# Altium schematic sheet PCB_Top.SchDoc
size A4; DocumentNumber: 1; SheetNumber: 1; SheetTotal: 8
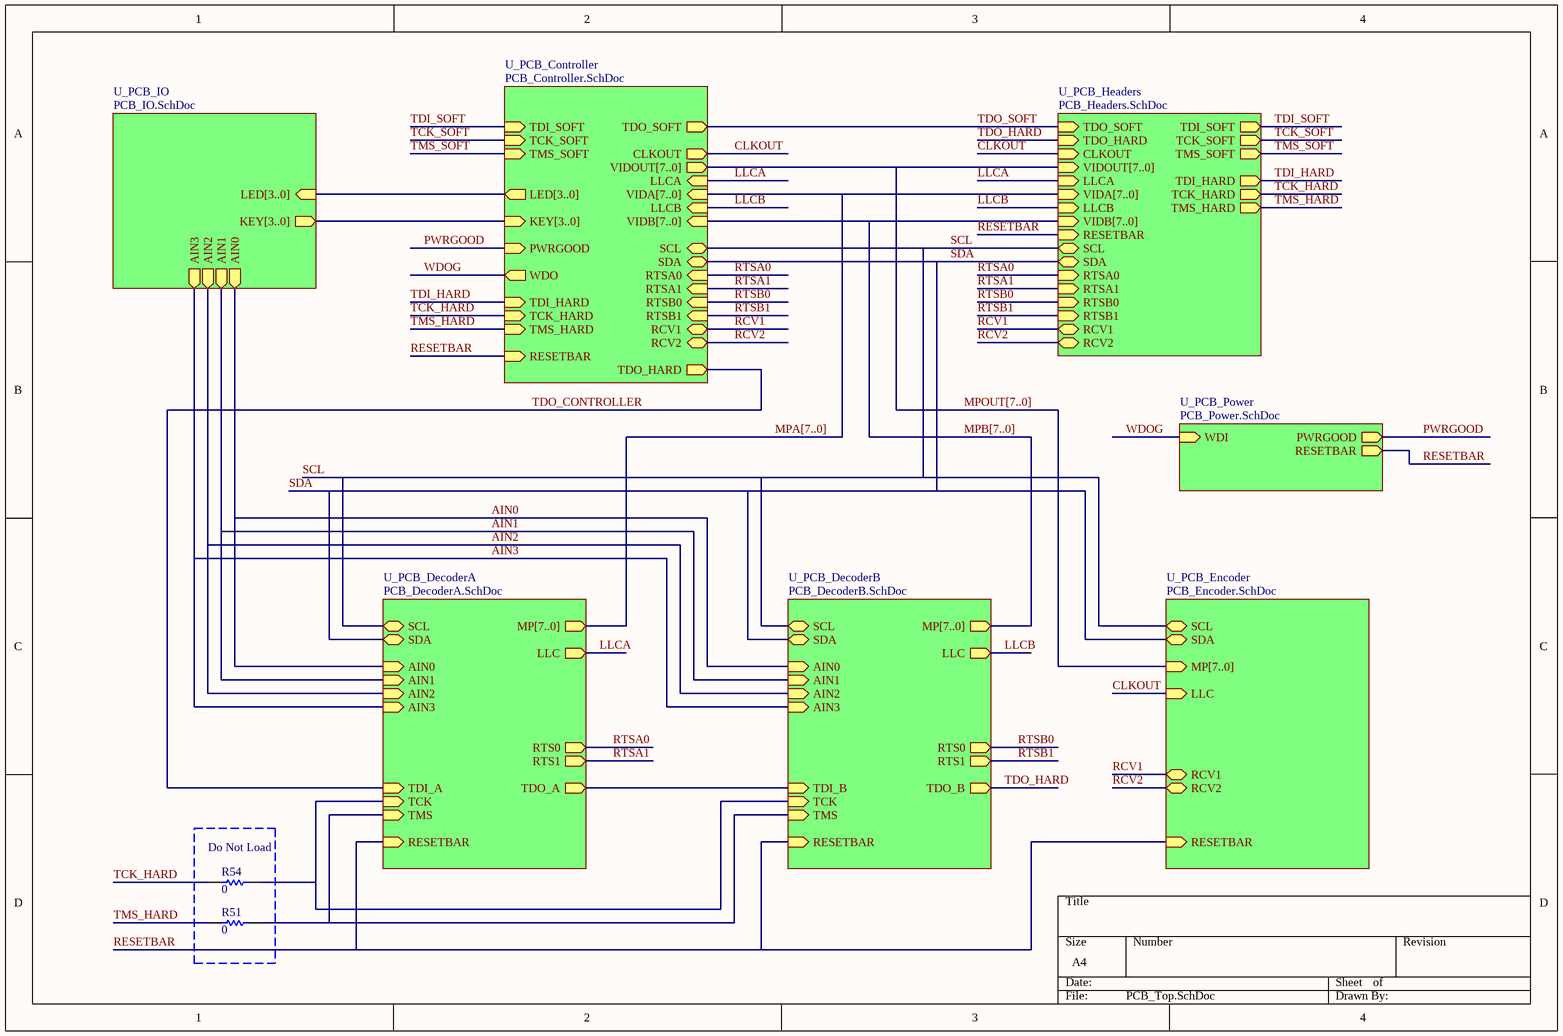
[diagram p0: PCB_Top.SchDoc]

## Parts
R51  0  [CC2012-0805]
R54  0  [CC2012-0805]

## Blocks framed on the sheet
Do Not Load: R51 R54

## Sub-sheets
U_PCB_Controller = PCB_Controller.SchDoc: TMS_HARD (in), TMS_SOFT (in), TCK_SOFT (in), TDI_SOFT (in), TDI_HARD (in), TCK_HARD (in), TDO_HARD (out), TDO_SOFT (out), CLKOUT (out), VIDOUT[7..0] (out), LLCA (in), LLCB (in), VIDA[7..0] (in), VIDB[7..0] (in), RESETBAR (in), SCL (bidir), SDA (bidir), RTSA0 (in), RTSA1 (in), RTSB0 (in), RTSB1 (in), RCV1 (bidir), RCV2 (bidir), KEY[3..0] (in), LED[3..0] (out), PWRGOOD (in), WDO (out)
U_PCB_DecoderA = PCB_DecoderA.SchDoc: SCL (bidir), SDA (bidir), TDI_A (in), TCK (in), TMS (in), TDO_A (out), AIN0 (in), AIN1 (in), AIN2 (in), AIN3 (in), MP[7..0] (out), LLC (out), RESETBAR (in), RTS0 (out), RTS1 (out)
U_PCB_DecoderB = PCB_DecoderB.SchDoc: SCL (bidir), SDA (bidir), TDI_B (in), TCK (in), TMS (in), TDO_B (out), AIN0 (in), AIN1 (in), AIN2 (in), AIN3 (in), MP[7..0] (out), LLC (out), RESETBAR (in), RTS0 (out), RTS1 (out)
U_PCB_Encoder = PCB_Encoder.SchDoc: MP[7..0] (in), LLC (in), SCL (bidir), SDA (bidir), RESETBAR (in), RCV1 (bidir), RCV2 (bidir)
U_PCB_Headers = PCB_Headers.SchDoc: TMS_HARD (out), TMS_SOFT (out), TCK_SOFT (out), TDI_SOFT (out), TDI_HARD (out), TCK_HARD (out), TDO_HARD (in), TDO_SOFT (in), CLKOUT (in), VIDOUT[7..0] (in), LLCA (in), LLCB (in), VIDA[7..0] (in), VIDB[7..0] (in), RESETBAR (in), SCL (bidir), SDA (bidir), RTSA0 (in), RTSA1 (in), RTSB0 (in), RTSB1 (in), RCV1 (bidir), RCV2 (bidir)
U_PCB_IO = PCB_IO.SchDoc: AIN0 (out), AIN1 (out), AIN2 (out), AIN3 (out), KEY[3..0] (out), LED[3..0] (in)
U_PCB_Power = PCB_Power.SchDoc: PWRGOOD (out), RESETBAR (out), WDI (in)

## Nets
AIN0: sheet U_PCB_DecoderA/AIN0, sheet U_PCB_DecoderB/AIN0, sheet U_PCB_IO/AIN0
AIN1: sheet U_PCB_DecoderA/AIN1, sheet U_PCB_DecoderB/AIN1, sheet U_PCB_IO/AIN1
AIN2: sheet U_PCB_DecoderA/AIN2, sheet U_PCB_DecoderB/AIN2, sheet U_PCB_IO/AIN2
AIN3: sheet U_PCB_DecoderA/AIN3, sheet U_PCB_DecoderB/AIN3, sheet U_PCB_IO/AIN3
CLKOUT: sheet U_PCB_Headers/CLKOUT, sheet U_PCB_Encoder/LLC, sheet U_PCB_Controller/CLKOUT
LLCA: sheet U_PCB_DecoderA/LLC, sheet U_PCB_Headers/LLCA, sheet U_PCB_Controller/LLCA
LLCB: sheet U_PCB_DecoderB/LLC, sheet U_PCB_Headers/LLCB, sheet U_PCB_Controller/LLCB
PWRGOOD: sheet U_PCB_Controller/PWRGOOD, sheet U_PCB_Power/PWRGOOD
RCV1: sheet U_PCB_Headers/RCV1, sheet U_PCB_Encoder/RCV1, sheet U_PCB_Controller/RCV1
RCV2: sheet U_PCB_Headers/RCV2, sheet U_PCB_Encoder/RCV2, sheet U_PCB_Controller/RCV2
RESETBAR: sheet U_PCB_DecoderA/RESETBAR, sheet U_PCB_DecoderB/RESETBAR, sheet U_PCB_Headers/RESETBAR, sheet U_PCB_Encoder/RESETBAR, sheet U_PCB_Controller/RESETBAR, sheet U_PCB_Power/RESETBAR
RTSA0: sheet U_PCB_DecoderA/RTS0, sheet U_PCB_Headers/RTSA0, sheet U_PCB_Controller/RTSA0
RTSA1: sheet U_PCB_DecoderA/RTS1, sheet U_PCB_Headers/RTSA1, sheet U_PCB_Controller/RTSA1
RTSB0: sheet U_PCB_DecoderB/RTS0, sheet U_PCB_Headers/RTSB0, sheet U_PCB_Controller/RTSB0
RTSB1: sheet U_PCB_DecoderB/RTS1, sheet U_PCB_Headers/RTSB1, sheet U_PCB_Controller/RTSB1
SCL: sheet U_PCB_DecoderA/SCL, sheet U_PCB_DecoderB/SCL, sheet U_PCB_Headers/SCL, sheet U_PCB_Encoder/SCL, sheet U_PCB_Controller/SCL
SDA: sheet U_PCB_DecoderA/SDA, sheet U_PCB_DecoderB/SDA, sheet U_PCB_Headers/SDA, sheet U_PCB_Encoder/SDA, sheet U_PCB_Controller/SDA
TCK_HARD: R54.1 ; sheet U_PCB_Headers/TCK_HARD, sheet U_PCB_Controller/TCK_HARD
TCK_SOFT: sheet U_PCB_Headers/TCK_SOFT, sheet U_PCB_Controller/TCK_SOFT
TDI_HARD: sheet U_PCB_Headers/TDI_HARD, sheet U_PCB_Controller/TDI_HARD
TDI_SOFT: sheet U_PCB_Headers/TDI_SOFT, sheet U_PCB_Controller/TDI_SOFT
TDO_CONTROLLER: sheet U_PCB_DecoderA/TDI_A, sheet U_PCB_Controller/TDO_HARD
TDO_HARD: sheet U_PCB_DecoderB/TDO_B, sheet U_PCB_Headers/TDO_HARD
TDO_SOFT: sheet U_PCB_Headers/TDO_SOFT, sheet U_PCB_Controller/TDO_SOFT
TMS_HARD: R51.1 ; sheet U_PCB_Headers/TMS_HARD, sheet U_PCB_Controller/TMS_HARD
TMS_SOFT: sheet U_PCB_Headers/TMS_SOFT, sheet U_PCB_Controller/TMS_SOFT
WDOG: sheet U_PCB_Controller/WDO, sheet U_PCB_Power/WDI
NetR51_2: R51.2 ; sheet U_PCB_DecoderA/TMS, sheet U_PCB_DecoderB/TMS
NetR54_2: R54.2 ; sheet U_PCB_DecoderA/TCK, sheet U_PCB_DecoderB/TCK
(unnamed): sheet U_PCB_DecoderA/TDO_A, sheet U_PCB_DecoderB/TDI_B

## Buses and harness runs
bus MPA[7..0] = sheet U_PCB_Controller/VIDA[7..0] = sheet U_PCB_DecoderA/MP[7..0] = sheet U_PCB_Headers/VIDA[7..0]
bus MPB[7..0] = sheet U_PCB_Controller/VIDB[7..0] = sheet U_PCB_DecoderB/MP[7..0] = sheet U_PCB_Headers/VIDB[7..0]
bus MPOUT[7..0] = sheet U_PCB_Controller/VIDOUT[7..0] = sheet U_PCB_Encoder/MP[7..0] = sheet U_PCB_Headers/VIDOUT[7..0]
bus sheet U_PCB_Controller/KEY[3..0] = sheet U_PCB_IO/KEY[3..0]
bus sheet U_PCB_Controller/LED[3..0] = sheet U_PCB_IO/LED[3..0]

## Library data of the parts
R51 R54 = RES: Resistor; Fitted: True